# EAGLE schematic psu-12v (EAGLE 7.2.0)
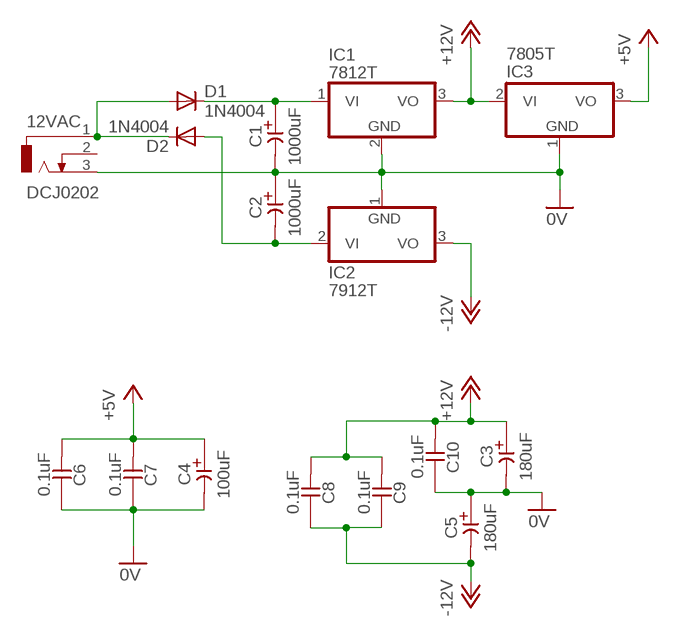
[diagram p0: schematic, sheet 1]

## Parts
12VAC  DCJ0202  [DCJ0202]
C1  1000uF  CE-USE5-8.5  [E5-8,5]
C2  1000uF  CE-USE5-8.5  [E5-8,5]
C3  180uF  CE-USE5-8.5  [E5-8,5]
C4  100uF  CE-USE5-8.5  [E5-8,5]
C5  180uF  CE-USE5-8.5  [E5-8,5]
C6  0.1uF  CC-US050-024X044  [C050-024X044]
C7  0.1uF  CC-US050-024X044  [C050-024X044]
C8  0.1uF  CC-US050-024X044  [C050-024X044]
C9  0.1uF  CC-US050-024X044  [C050-024X044]
C10  0.1uF  CC-US050-024X044  [C050-024X044]
D1  1N4004  [DO41-10]
D2  1N4004  [DO41-10]
IC1  7812T  [TO220H]
IC2  7912T  [TO220H]
IC3  7805T  7905T  [TO220H]

## Nets
0V: 12VAC.3 C1.- C2.+ C3.- C4.- C5.+ C6.1 C7.1 C10.1 IC1.2(GND) IC2.1(GND) IC3.1(GND)
+5V: C4.+ C6.2 C7.2 IC3.3(VO)
+12V: C3.+ C8.2 C9.2 C10.2 IC1.3(VO) IC3.2(VI)
-12V: C5.- C8.1 C9.1 IC2.3(VO)
N$2: 12VAC.1 D1.A D2.C
N$3: C1.+ D1.C IC1.1(VI)
N$5: C2.- D2.A IC2.2(VI)
Unconnected: 12VAC.2

## Library data of the parts
12VAC = con-jack:DCJ0202: DC POWER JACK Source: DCJ0202.pdf; OC_FARNELL: unknown; OC_NEWARK: unknown
C1-C5 = _common:CE-US: ELECTROLYTIC CAPACITOR, US symbol
C6-C10 = _common:CC-US: CAPACITOR, US symbol
D1 D2 = diode:1N4004: DIODE general purpose rectifier, 1 A
IC1 = linear:78*: Positive VOLTAGE REGULATOR Source: http://cache.national.com/ds/LM/LM78L05.pdf http://www.fairchildsemi.com/ds/LM/LM7805.pdf
IC2 IC3 = linear:79*: Negative VOLTAGE REGULATOR